# EasyEDA Pro project project.epro, schematic Core Memory Line Driver Block v2
Board Name: Core Memory Line Driver Block v2; Create Date: 2025-06-02; Page Name: P1; Project Name: Retro Core 16x32 Motherboard; Schematic Name: Core Memory Line Driver Block v2; Update Date: 2025-06-17; Company: EasyEDA.com; Drawn: EasyEDA; Page Size: A4; Part Number: JLCPCB-002; Reviewed: EasyEDA; Version: V0.1
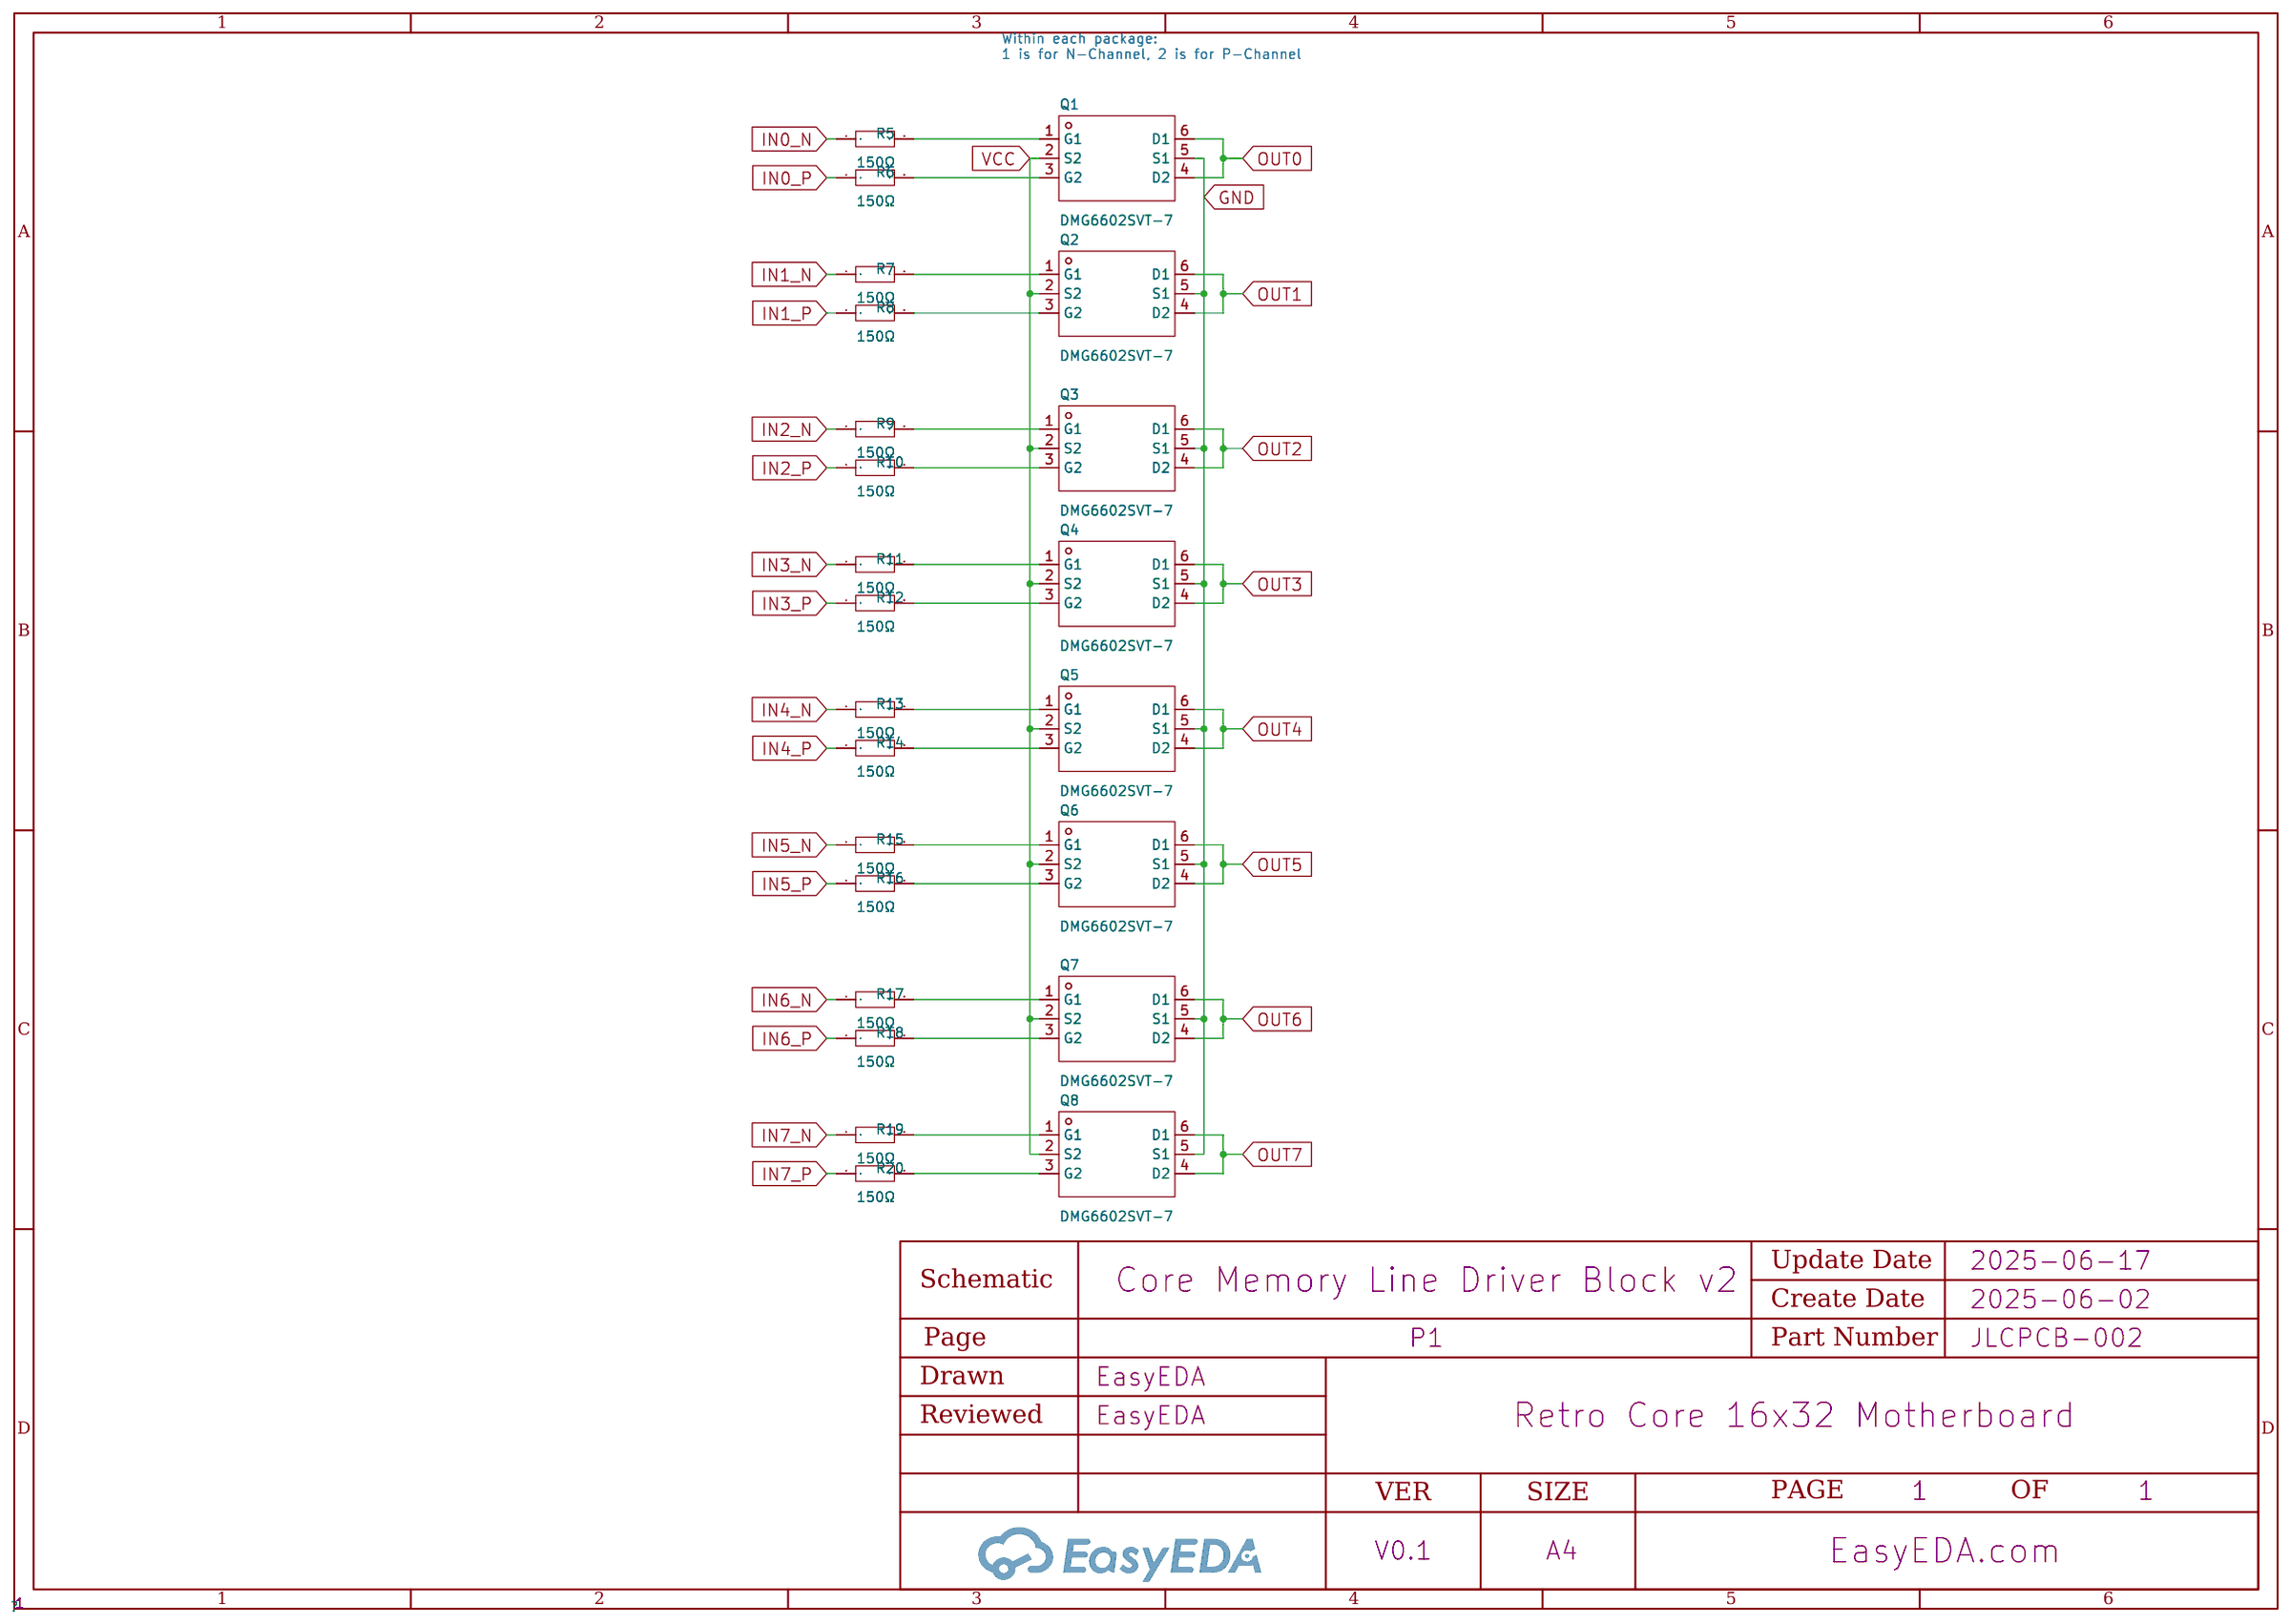
[diagram p0: schematic sheet]

## Parts
Q1  DMG6602SVT-7  [TSOT-23-6_L2.9-W1.6-P0.95-LS2.8-BR]
Q2  DMG6602SVT-7  [TSOT-23-6_L2.9-W1.6-P0.95-LS2.8-BR]
Q3  DMG6602SVT-7  [TSOT-23-6_L2.9-W1.6-P0.95-LS2.8-BR]
Q4  DMG6602SVT-7  [TSOT-23-6_L2.9-W1.6-P0.95-LS2.8-BR]
Q5  DMG6602SVT-7  [TSOT-23-6_L2.9-W1.6-P0.95-LS2.8-BR]
Q6  DMG6602SVT-7  [TSOT-23-6_L2.9-W1.6-P0.95-LS2.8-BR]
Q7  DMG6602SVT-7  [TSOT-23-6_L2.9-W1.6-P0.95-LS2.8-BR]
Q8  DMG6602SVT-7  [TSOT-23-6_L2.9-W1.6-P0.95-LS2.8-BR]
R5  150Ω  [R0603]
R6  150Ω  [R0603]
R7  150Ω  [R0603]
R8  150Ω  [R0603]
R9  150Ω  [R0603]
R10  150Ω  [R0603]
R11  150Ω  [R0603]
R12  150Ω  [R0603]
R13  150Ω  [R0603]
R14  150Ω  [R0603]
R15  150Ω  [R0603]
R16  150Ω  [R0603]
R17  150Ω  [R0603]
R18  150Ω  [R0603]
R19  150Ω  [R0603]
R20  150Ω  [R0603]

## Library data of the parts
Q1-Q8 = DMG6602SVT-7: Type:NChannel+PChannel Drain Source Voltage (Vdss): Continuous Drain Current (Id):； Power Dissipation (Pd): Drain Source On Resistance (RDS(on)@Vgs,Id): Gate Threshold Voltage (Vgs(th)@Id):2.3V@250uA Total Gate Charge (Qg@Vgs):13nC@10V Input Capacitance (; LCSC Part Name: N沟道+P沟道 耐压:30V 电流:3.4A 电流:2.8A; Supplier Part: C110497; Manufacturer: DIODES(美台); Supplier Footprint: TSOT-23-6; JLCPCB Part Class: Extended Part; Datasheet: https://atta.szlcsc.com/upload/public/pdf/source/20170427/1493286394320.pdf; Supplier: LCSC; Type: NChannel+PChannel; Continuous Drain Current (Id): ；; Gate Threshold Voltage (Vgs(th)@Id): 2.3V@250uA; Total Gate Charge (Qg@Vgs): 13nC@10V; Input Capacitance (Ciss@Vds): 400pF@15V; Operating Temperature: -55℃~+150℃@(Tj)
R5-R20 = 0603WAF1500T5E: Type:Thick Film Resistors Resistance: Tolerance:±1% Tolerance:±1% Power(Watts): Overload Voltage (Max): Temperature Coefficient:±100ppm/℃ Temperature Coefficient:±100ppm/℃ Operating Temperature Range:-55℃~+155℃ Operating Temperature Range:-55℃~+155℃; LCSC Part Name: 150Ω ±1% 100mW 厚膜电阻; Supplier Part: C22808; Manufacturer: UNI-ROYAL(厚声); Supplier Footprint: 0603; JLCPCB Part Class: Basic Part; Datasheet: https://atta.szlcsc.com/upload/public/pdf/source/20200306/C422600_1E6D84923E4A46A82E41ADD87F860B5C.pdf; Supplier: LCSC; Type: Thick Film Resistors; Tolerance: ±1%; Temperature Coefficient: ±100ppm/℃; Operating Temperature Range: -55℃~+155℃

## Nets
GND: Q1.5(S1) Q2.5(S1) Q3.5(S1) Q4.5(S1) Q5.5(S1) Q6.5(S1) Q7.5(S1) Q8.5(S1)
VCC: Q1.2(S2) Q2.2(S2) Q3.2(S2) Q4.2(S2) Q5.2(S2) Q6.2(S2) Q7.2(S2) Q8.2(S2)
IN0_N: R5.1
IN0_P: R6.1
IN1_N: R7.1
IN1_P: R8.1
IN2_N: R9.1
IN2_P: R10.1
IN3_N: R11.1
IN3_P: R12.1
IN4_N: R13.1
IN4_P: R14.1
IN5_N: R15.1
IN5_P: R16.1
IN6_N: R17.1
IN6_P: R18.1
IN7_N: R19.1
IN7_P: R20.1
OUT0: Q1.4(D2) Q1.6(D1)
OUT1: Q2.4(D2) Q2.6(D1)
OUT2: Q3.4(D2) Q3.6(D1)
OUT3: Q4.4(D2) Q4.6(D1)
OUT4: Q5.4(D2) Q5.6(D1)
OUT5: Q6.4(D2) Q6.6(D1)
OUT6: Q7.4(D2) Q7.6(D1)
OUT7: Q8.4(D2) Q8.6(D1)
$1N959: Q1.1(G1) R5.2
$1N972: Q2.1(G1) R7.2
$1N982: Q2.3(G2) R8.2
$1N1257: Q4.1(G1) R11.2
$1N1261: Q3.3(G2) R10.2
$1N1273: Q3.1(G1) R9.2
$1N2409: Q1.3(G2) R6.2
$1N2651: Q4.3(G2) R12.2
$1N7281: Q6.1(G1) R15.2
$1N7282: Q6.3(G2) R16.2
$1N7283: Q7.1(G1) R17.2
$1N7284: Q7.3(G2) R18.2
$1N7285: Q8.1(G1) R19.2
$1N7286: Q8.3(G2) R20.2
$1N7287: Q5.1(G1) R13.2
$1N7288: Q5.3(G2) R14.2

## Notes on the sheet
- Within each package:
  1 is for N-Channel, 2 is for P-Channel
